# Altium schematic sheet Programer Connectors_SPI.SchDoc
size 43 x 33 mm
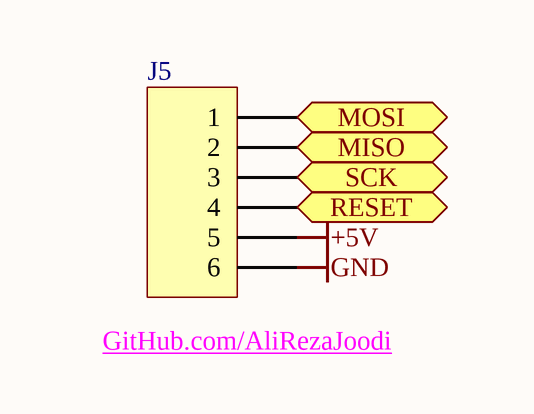
[diagram p0: Programer Connectors_SPI.SchDoc]

## Parts
J5  Header 6  [HDR1X6]  (value not drawn)

## Ports
MISO (out), MOSI (out), RESET (out), SCK (out)

## Nets
+5V: J5.5
GND: J5.6
MISO: J5.2 ; port MISO
MOSI: J5.1 ; port MOSI
RESET: J5.4 ; port RESET
SCK: J5.3 ; port SCK

## Notes on the sheet
- (near J5) GitHub.com/AliRezaJoodi

## Library data of the parts
J5 = Header 6: Header, 6-Pin; LatestRevisionDate: 17-Jul-2002; LatestRevisionNote: Re-released for DXP Platform.; Publisher: Altium Limited